# EAGLE design ioboard (EAGLE 9.6.2)
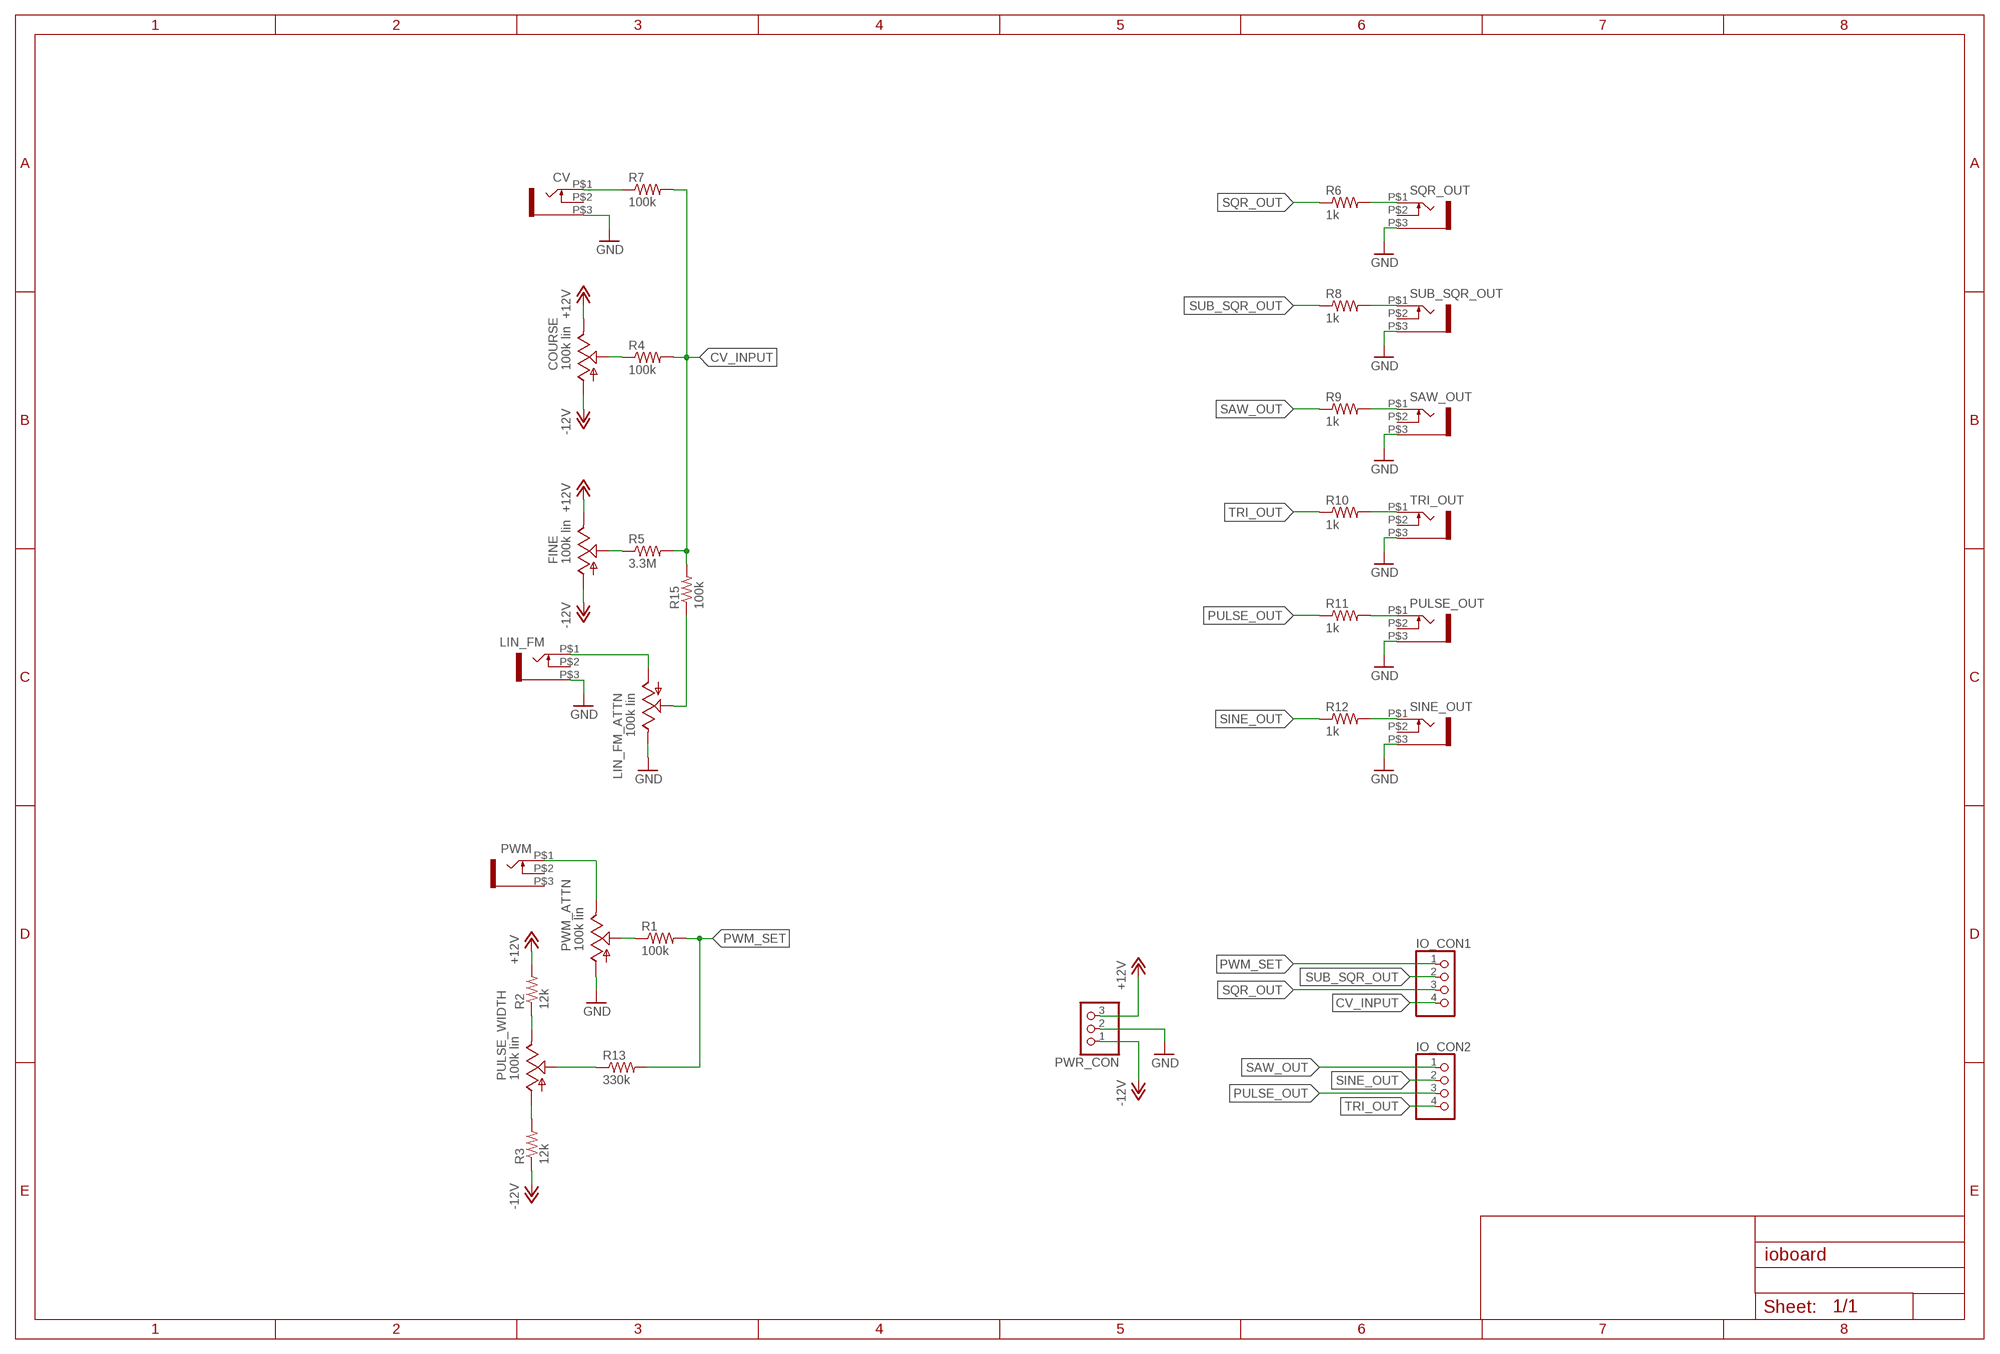
[diagram p0: schematic, sheet 1]

## Parts
COURSE  100k lin  ALPHA-9MMA  [EVUF]
CV  WQP-PJ301M-12_JACK  [WQP-PJ301M-12_JACK]
FINE  100k lin  ALPHA-9MMA  [EVUF]
IO_CON1  PINHD-1X4  [1X04]
IO_CON2  PINHD-1X4  [1X04]
LIN_FM  WQP-PJ301M-12_JACK  [WQP-PJ301M-12_JACK]
LIN_FM_ATTN  100k lin  ALPHA-9MMA  [EVUF]
PULSE_OUT  WQP-PJ301M-12_JACK  [WQP-PJ301M-12_JACK]
PULSE_WIDTH  100k lin  ALPHA-9MMA  [EVUF]
PWM  WQP-PJ301M-12_JACK  [WQP-PJ301M-12_JACK]
PWM_ATTN  100k lin  ALPHA-9MMA  [EVUF]
PWR_CON  PINHD-1X3  [1X03]
R1  100k  R-US_0207/7  [0207/7]
R2  12k  R-US_0207/7  [0207/7]
R3  12k  R-US_0207/7  [0207/7]
R4  100k  R-US_0207/7  [0207/7]
R5  3.3M  R-US_0207/7  [0207/7]
R6  1k  R-US_0207/7  [0207/7]
R7  100k  R-US_0207/7  [0207/7]
R8  1k  R-US_0207/7  [0207/7]
R9  1k  R-US_0207/7  [0207/7]
R10  1k  R-US_0207/7  [0207/7]
R11  1k  R-US_0207/7  [0207/7]
R12  1k  R-US_0207/7  [0207/7]
R13  330k  R-US_0207/7  [0207/7]
R15  100k  R-US_0207/7  [0207/7]
SAW_OUT  WQP-PJ301M-12_JACK  [WQP-PJ301M-12_JACK]
SINE_OUT  WQP-PJ301M-12_JACK  [WQP-PJ301M-12_JACK]
SQR_OUT  WQP-PJ301M-12_JACK  [WQP-PJ301M-12_JACK]
SUB_SQR_OUT  WQP-PJ301M-12_JACK  [WQP-PJ301M-12_JACK]
TRI_OUT  WQP-PJ301M-12_JACK  [WQP-PJ301M-12_JACK]

## Nets
+12V: COURSE.3(E) FINE.3(E) PWR_CON.3 R2.2
-12V: COURSE.1(A) FINE.1(A) PWR_CON.1 R3.1
CV_INPUT: IO_CON1.4 R4.2 R5.2 R7.2 R15.2
GND: CV.P$3 LIN_FM.P$3 LIN_FM_ATTN.3(E) PULSE_OUT.P$3 PWM_ATTN.1(A) PWR_CON.2 SAW_OUT.P$3 SINE_OUT.P$3 SQR_OUT.P$3 SUB_SQR_OUT.P$3 TRI_OUT.P$3
N$1: COURSE.2(S) R4.1
N$2: FINE.2(S) R5.1
N$3: PULSE_WIDTH.3(E) R2.1
N$4: CV.P$1 R7.1
N$5: R6.2 SQR_OUT.P$1
N$6: R8.2 SUB_SQR_OUT.P$1
N$7: R9.2 SAW_OUT.P$1
N$8: R10.2 TRI_OUT.P$1
N$9: PULSE_WIDTH.1(A) R3.2
N$10: R12.2 SINE_OUT.P$1
N$11: PULSE_WIDTH.2(S) R13.1
N$12: PWM.P$1 PWM_ATTN.3(E)
N$13: PULSE_OUT.P$1 R11.2
N$14: PWM_ATTN.2(S) R1.1
N$43: LIN_FM.P$1 LIN_FM_ATTN.1(A)
N$44: LIN_FM_ATTN.2(S) R15.1
PULSE_OUT: IO_CON2.3 R11.1
PWM_SET: IO_CON1.1 R1.2 R13.2
SAW_OUT: IO_CON2.1 R9.1
SINE_OUT: IO_CON2.2 R12.1
SQR_OUT: IO_CON1.3 R6.1
SUB_SQR_OUT: IO_CON1.2 R8.1
TRI_OUT: IO_CON2.4 R10.1
Unconnected: CV.P$2 LIN_FM.P$2 PULSE_OUT.P$2 PWM.P$2 PWM.P$3 SAW_OUT.P$2 SINE_OUT.P$2 SQR_OUT.P$2 SUB_SQR_OUT.P$2 TRI_OUT.P$2

## Library data of the parts
COURSE FINE LIN_FM_ATTN PULSE_WIDTH PWM_ATTN = TomW:ALPHA-9MM: 9 mm Square Rotary Potentiometers Source: Panasonic
CV LIN_FM PULSE_OUT PWM SAW_OUT SINE_OUT SQR_OUT SUB_SQR_OUT TRI_OUT = thonkiconn:WQP-PJ301M-12_JACK
IO_CON1 IO_CON2 = pinhead:PINHD-1X4: PIN HEADER
PWR_CON = pinhead:PINHD-1X3: PIN HEADER
R1-R13 R15 = rcl:R-US_: RESISTOR, American symbol; SPICEPREFIX: R

## Board
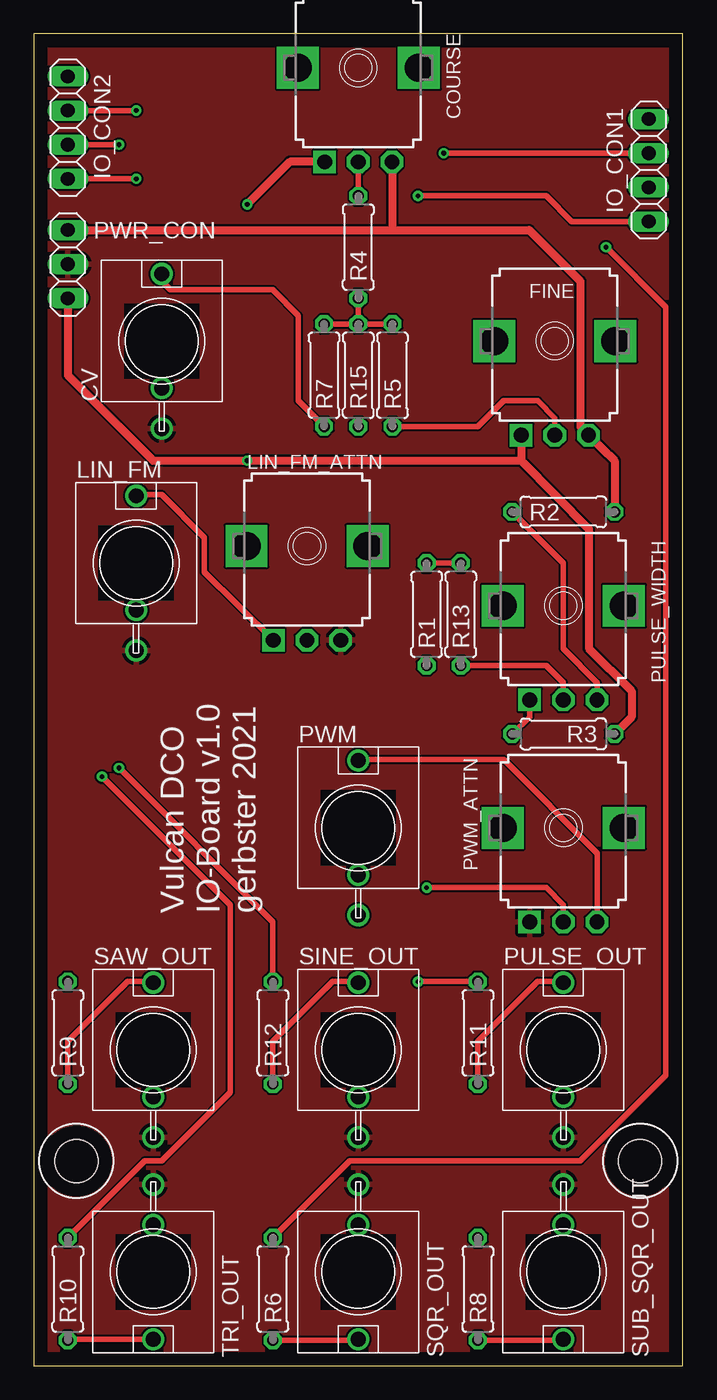
[diagram p1: board, top side]
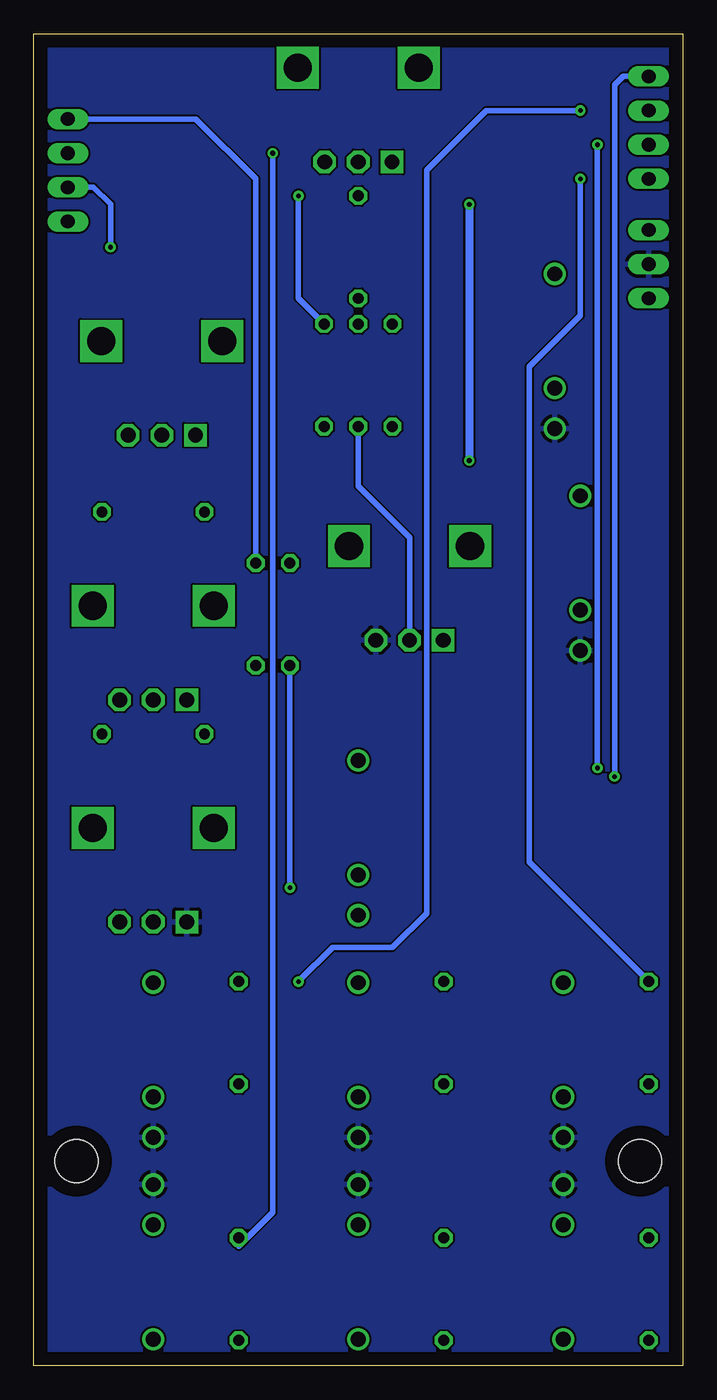
[diagram p2: board, bottom side, seen from below]

Size 48.26 x 99.06 mm. Coordinates in mm from the lower left corner, seen from the top.
Outline: 0,0 48.26,0 48.26,99.06 0,99.06 0,0
Copper layers (1*16): Top 0.035mm / dielectric 1.5mm / Bottom 0.035mm
Design rules "default": minimum track width 6mil, minimum drill 0.35mm, track to track 6mil, track to pad 6mil, pad to pad 6mil, via to via 6mil, smd to smd 6mil, copper to edge 40mil, drill to drill 6mil, minimum pad ring 10mil, minimum via ring 8mil, stop-mask expansion 4mil, vias tented up to drill 0mil, thermal gap 10mil
Holes 3.2 mm at 3.17,15.24 45.09,15.24

### Footprints (pad centres in the part's own frame; a part is rotated, then mirrored left to right if it is on the bottom)
EVUF = drill 1.1 pad 1.676 square: 1 -2.5,-7 | drill 1.1 pad 1.676 octagon: 2 0,-7; 3 2.5,-7 | drill 2.1 pad 2.8 square: M1 4.5,0; M2 -4.5,0
WQP-PJ301M-12_JACK = drill 1.1: P$1 0,5; P$2 0,-3.5; P$3 0,-6.5
1X04 = drill 1.016 long: 1 -3.81,0; 2 -1.27,0; 3 1.27,0; 4 3.81,0
1X03 = drill 1.016 long: 1 -2.54,0; 2 0,0; 3 2.54,0
0207/7 = drill 0.813 octagon: 1 -3.81,0; 2 3.81,0

### Placement (x,y rotation side)
COURSE  24.13,96.52 0 top
CV  9.53,76.2 0 top
FINE  38.73,76.2 0 top
IO_CON1  45.72,88.9 270 top
IO_CON2  2.54,92.08 90 top
LIN_FM  7.62,59.69 0 top
LIN_FM_ATTN  20.32,60.96 0 top
PULSE_OUT  39.37,23.5 0 top
PULSE_WIDTH  39.37,56.52 0 top
PWM  24.13,40.01 0 top
PWM_ATTN  39.37,40.01 0 top
PWR_CON  2.54,81.92 90 top
R1  29.21,55.88 90 top
R2  39.37,63.5 0 top
R3  39.37,46.99 180 top
R4  24.13,83.19 270 top
R5  26.67,73.66 90 top
R6  17.78,5.71 270 top
R7  21.59,73.66 90 top
R8  33.02,5.71 270 top
R9  2.54,24.77 270 top
R10  2.54,5.71 270 top
R11  33.02,24.77 270 top
R12  17.78,24.77 270 top
R13  31.75,55.88 90 top
R15  24.13,73.66 90 top
SAW_OUT  8.89,23.5 0 top
SINE_OUT  24.13,23.5 0 top
SQR_OUT  24.13,6.99 180 top
SUB_SQR_OUT  39.37,6.99 180 top
TRI_OUT  8.89,6.99 180 top

### Tracks (layer width: path | path; a pad name or v marks a point on that pad's centre or on a via)
+12V
  Top 0.61: PWR_CON.3 26.67,84.45 | 26.67,84.45 36.83,84.45 40.64,80.64 40.64,69.83 FINE.3 43.18,67.3 R2.2 | COURSE.3 26.67,89.52 26.67,84.45
-12V  (via drill 0.35)
  Top 0.61: PWR_CON.1 2.54,73.66 8.89,67.31 v15.88,67.31 36.23,67.31 | FINE.1 36.23,67.31 | COURSE.1 21.59,89.53 19.05,89.53 v15.88,86.36 | 36.23,67.31 41.27,62.23 41.27,53.34 44.45,50.16 44.45,48.26 R3.1
  Bottom 0.61: v15.88,86.36 v15.88,67.31
CV_INPUT  (via drill 0.35)
  Top 0.406: R4.2 R15.2 | R15.2 R7.2 | R5.2 R15.2 | IO_CON1.4 40.01,85.09 38.1,87 v28.57,87
  Bottom 0.406: v28.57,87 28.57,79.38 R5.2
GND
  pour Top: 0,99.06 48.26,99.06 48.26,0 0,0
  pour Bottom: 0,99.06 0,0 48.26,0 48.26,99.06
N$1
  Top 0.406: COURSE.2 R4.1
N$2
  Top 0.406: R5.1 33.02,69.85 34.92,71.75 37.47,71.75 38.73,70.48 FINE.2
N$3
  Top 0.406: R2.1 39.37,59.69 39.37,53.34 41.91,50.78 PULSE_WIDTH.3
N$4
  Top 0.406: CV.P$1 9.53,80.64 10.16,80.01 17.78,80.01 19.68,78.11 19.68,71.75 R7.1
N$5
  Top 0.406: SQR_OUT.P$1 24.13,1.91 R6.2
N$6
  Top 0.406: SUB_SQR_OUT.P$1 39.37,1.91 R8.2
N$7
  Top 0.406: R9.2 2.54,24.13 6.99,28.57 8.89,28.57 SAW_OUT.P$1
N$8
  Top 0.406: TRI_OUT.P$1 2.54,1.99 R10.2
N$9
  Top 0.406: PULSE_WIDTH.1 36.87,48.26 R3.2
N$10
  Top 0.406: SINE_OUT.P$1 24.13,28.57 22.23,28.57 17.78,24.13 R12.2
N$11
  Top 0.406: R13.1 38.1,52.07 39.37,50.8 PULSE_WIDTH.2
N$12
  Top 0.406: PWM_ATTN.3 41.91,33.01 41.91,38.1 34.92,45.09 24.13,45.09 PWM.P$1
N$13
  Top 0.406: PULSE_OUT.P$1 arc60 39.37,28.57 37.47,28.57 33.02,24.13 R11.2
N$14  (via drill 0.35)
  Top 0.406: PWM_ATTN.2 39.37,34.29 38.1,35.56 v29.21,35.56
  Bottom 0.406: v29.21,35.56 R1.1
N$43
  Top 0.406: LIN_FM.P$1 7.62,64.77 9.53,64.77 12.7,61.59 12.7,59.04 LIN_FM_ATTN.1
N$44
  Bottom 0.406: R15.1 24.13,65.41 20.32,61.59 LIN_FM_ATTN.2
PULSE_OUT  (via drill 0.35)
  Top 0.406: IO_CON2.3 v7.62,93.34 | v28.57,28.57 R11.1
  Bottom 0.406: v7.62,93.34 14.61,93.34 19.05,88.9 19.05,33.66 21.59,31.11 26.04,31.11 v28.57,28.57
PWM_SET
  Top 0.406: R1.2 R13.2
  Bottom 0.406: IO_CON1.1 36.2,92.71 31.75,88.27 R13.2
SAW_OUT  (via drill 0.35)
  Top 0.406: IO_CON2.1 v7.62,88.27
  Bottom 0.406: v7.62,88.27 7.62,78.11 11.43,74.3 11.43,37.47 R9.1
SINE_OUT  (via drill 0.35)
  Top 0.406: IO_CON2.2 v6.35,90.81 | v6.35,44.45 17.78,33.02 R12.1
  Bottom 0.406: v6.35,90.81 v6.35,44.45
SQR_OUT  (via drill 0.35)
  Top 0.406: v42.55,83.19 46.99,78.74 46.99,21.59 40.64,15.24 23.5,15.24 R6.1
  Bottom 0.406: IO_CON1.3 43.81,87.63 42.55,86.36 v42.55,83.19
SUB_SQR_OUT  (via drill 0.35)
  Top 0.406: v30.48,90.17 IO_CON1.2
  Bottom 0.406: R8.1 33.02,8.89 30.48,11.43 v30.48,90.17
TRI_OUT  (via drill 0.35)
  Top 0.406: R10.1 8.26,15.24 9.53,15.24 14.61,20.32 14.61,34.29 v5.08,43.81
  Bottom 0.406: v5.08,43.81 5.08,95.25 4.45,95.89 IO_CON2.4

### Text on the board
tNames: Vulcan DCO / IO-Board v1.0 / gerbster 2021